# Altium project RUT2CLOUDPrjPcb.PrjPcb (part 1 of 2)
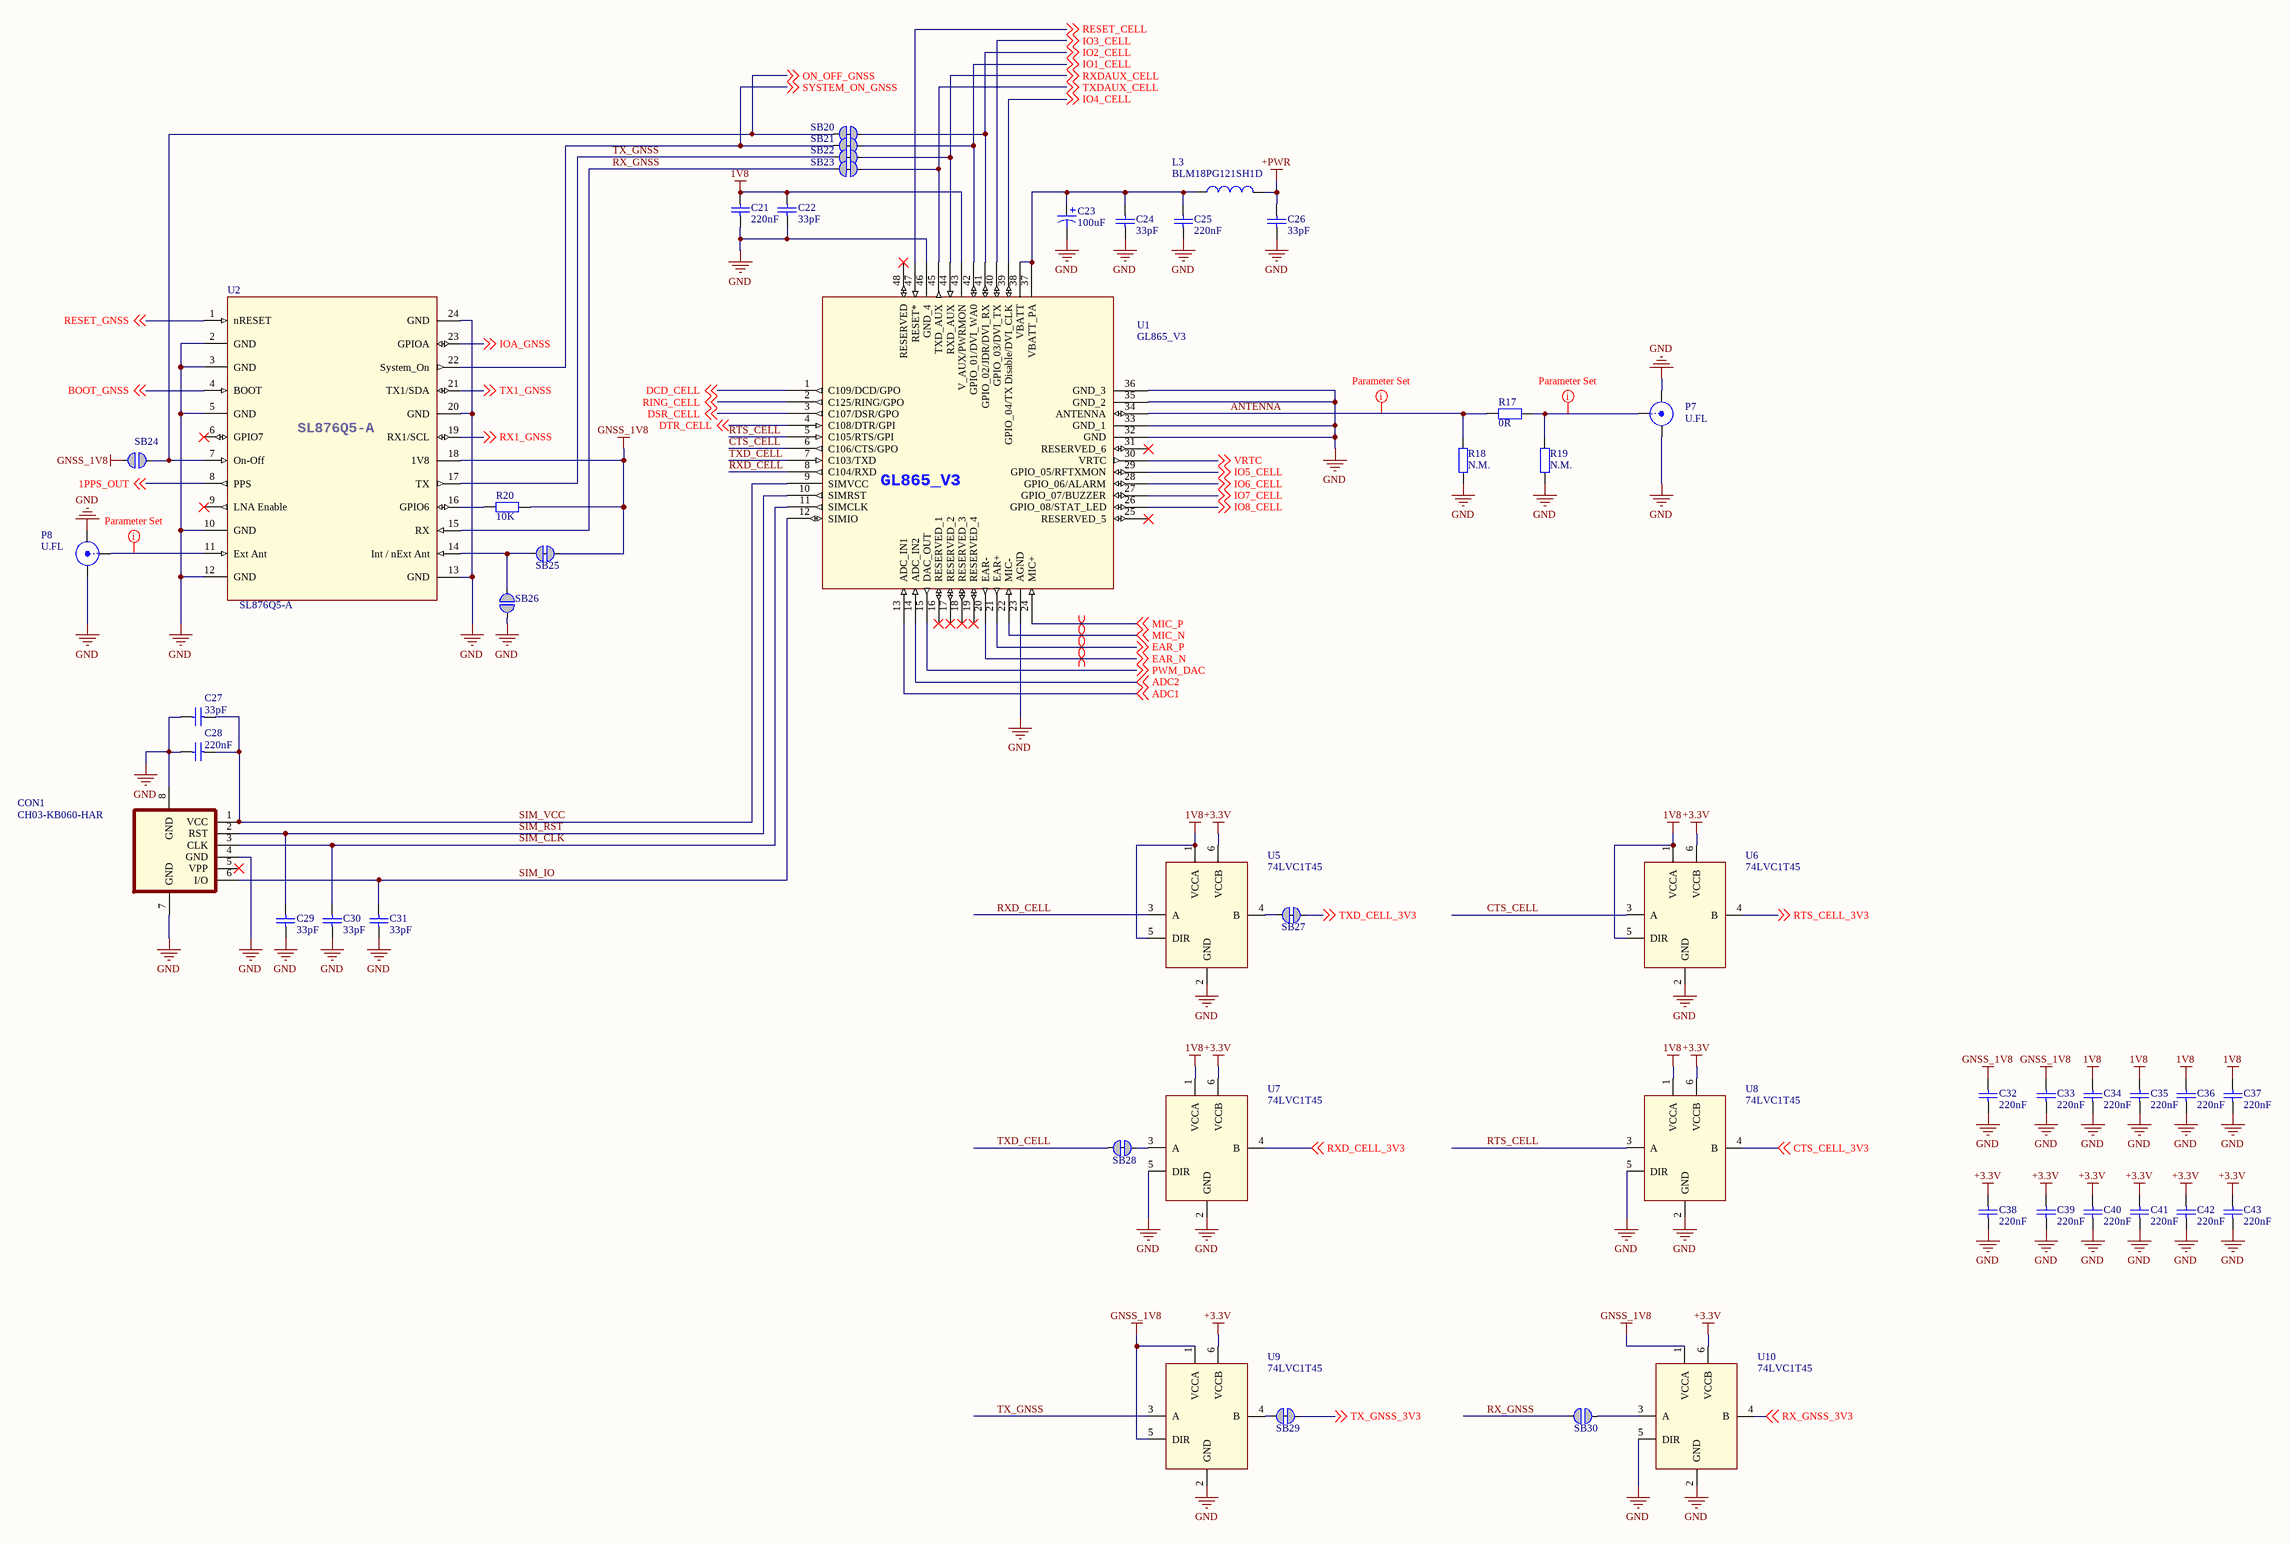
[diagram p0: Modem GNSS.SchDoc]
6 sheets, 262 parts. Net scope: global (net labels, ports and power ports of the same name join across sheets).
Board files: RUT2CLOUD.PcbDoc, RUT2CLOUD_panel.PcbDoc
Sheets:
  Modem GNSS.SchDoc
  Power management.SchDoc
  Sensors.SchDoc
  Connectors.SchDoc
  ST Link.SchDoc
  BLE_Controller.SchDoc

## Sheet Modem GNSS.SchDoc
size A2

### Parts
C21  value 220nF  [C0402]  (hidden comment: Cap Semi)
C22  value 33pF  [C0402]  (hidden comment: Cap Semi)
C23  value 100uF  [Case-B]  (hidden comment: electrolytic capacitor)
C24  value 33pF  [C0402]  (hidden comment: Cap Semi)
C25  value 220nF  [C0402]  (hidden comment: Cap Semi)
C26  value 33pF  [C0402]  (hidden comment: Cap Semi)
C27  value 33pF  [C0402]  (hidden comment: Cap Semi)
C28  value 220nF  [C0402]  (hidden comment: Cap Semi)
C29  value 33pF  [C0402]  (hidden comment: Cap Semi)
C30  value 33pF  [C0402]  (hidden comment: Cap Semi)
C31  value 33pF  [C0402]  (hidden comment: Cap Semi)
C32  value 220nF  [C0402]  (hidden comment: Cap Semi)
C33  value 220nF  [C0402]  (hidden comment: Cap Semi)
C34  value 220nF  [C0402]  (hidden comment: Cap Semi)
C35  value 220nF  [C0402]  (hidden comment: Cap Semi)
C36  value 220nF  [C0402]  (hidden comment: Cap Semi)
C37  value 220nF  [C0402]  (hidden comment: Cap Semi)
C38  value 220nF  [C0402]  (hidden comment: Cap Semi)
C39  value 220nF  [C0402]  (hidden comment: Cap Semi)
C40  value 220nF  [C0402]  (hidden comment: Cap Semi)
C41  value 220nF  [C0402]  (hidden comment: Cap Semi)
C42  value 220nF  [C0402]  (hidden comment: Cap Semi)
C43  value 220nF  [C0402]  (hidden comment: Cap Semi)
CON1  CH03-KB060-HAR  [CH03-KB]
L3  value BLM18PG121SH1D  [L0603]  (hidden comment: Inductor)
P7  U.FL  [U.FL_Connector_Male]
P8  U.FL  [U.FL_Connector_Male]
R17  value 0R  [R0402]  (hidden comment: Res2)
R18  value N.M.  [R0402]  (hidden comment: Res2)  (no BOM)
R19  value N.M.  [R0402]  (hidden comment: Res2)  (no BOM)
R20  value 10K  [R0402]  (hidden comment: Res2)
SB20  Solderbridge  [Solderbridge_Shorted]  (value not drawn)  (net tie, no BOM)
SB21  Solderbridge  [Solderbridge_Shorted]  (value not drawn)  (net tie, no BOM)
SB22  Solderbridge  [Solderbridge_Shorted]  (value not drawn)  (net tie, no BOM)
SB23  Solderbridge  [Solderbridge_Shorted]  (value not drawn)  (net tie, no BOM)
SB24  Solderbridge  [Solderbridge]  (value not drawn)  (no BOM)
SB25  Solderbridge  [Solderbridge_Shorted]  (value not drawn)  (net tie, no BOM)
SB26  Solderbridge  [Solderbridge]  (value not drawn)  (no BOM)
SB27  Solderbridge  [Solderbridge_Shorted]  (value not drawn)  (net tie, no BOM)
SB28  Solderbridge  [Solderbridge_Shorted]  (value not drawn)  (net tie, no BOM)
SB29  Solderbridge  [Solderbridge_Shorted]  (value not drawn)  (net tie, no BOM)
SB30  Solderbridge  [Solderbridge]  (value not drawn)  (no BOM)
U1  GL865_V3  [XL865XXX]
U2  SL876Q5-A  [SL876Q5-A]
U5  74LVC1T45  [X2-DFN1410-6]
U6  74LVC1T45  [X2-DFN1410-6]
U7  74LVC1T45  [X2-DFN1410-6]
U8  74LVC1T45  [X2-DFN1410-6]
U9  74LVC1T45  [X2-DFN1410-6]
U10  74LVC1T45  [X2-DFN1410-6]

### Nets
1V8: C21.2 C22.2 C34.1 C35.1 C36.1 C37.1 U1.43(V_AUX/PWRMON) U5.1(VCCA) U5.5(DIR) U6.1(VCCA) U6.5(DIR) U7.1(VCCA) U8.1(VCCA)
+3.3V: C38.1 C39.1 C40.1 C41.1 C42.1 C43.1 U5.6(VCCB) U6.6(VCCB) U7.6(VCCB) U8.6(VCCB) U9.6(VCCB) U10.6(VCCB)
+PWR: C26.2 L3.2
GND: C21.1 C22.1 C23.2 C24.1 C25.1 C26.1 C27.2 C28.2 C29.2 C30.2 C31.2 C32.2 C33.2 C34.2 C35.2 C36.2 C37.2 C38.2 C39.2 C40.2 C41.2 C42.2 C43.2 CON1.4(GND) CON1.7(GND) CON1.8(GND) P7.2(Y) P7.3(Y) P8.2(Y) P8.3(Y) R18.2 R19.2 SB26.1 U1.23(AGND) U1.32(GND) U1.33(GND_1) U1.35(GND_2) U1.36(GND_3) U1.46(GND_4) U2.2(GND) U2.3(GND) U2.5(GND) U2.10(GND) U2.12(GND) U2.13(GND) U2.20(GND) U2.24(GND) U5.2(GND) U6.2(GND) U7.2(GND) U7.5(DIR) U8.2(GND) U8.5(DIR) U9.2(GND) U10.2(GND) U10.5(DIR)
GNSS_1V8: C32.1 C33.1 R20.2 SB24.2 SB25.1 U2.18(1V8) U9.1(VCCA) U9.5(DIR) U10.1(VCCA)
1PPS_OUT: U2.8(PPS) ; off-sheet 1PPS_OUT
ADC1: U1.13(ADC_IN1) ; off-sheet ADC1
ADC2: U1.14(ADC_IN2) ; off-sheet ADC2
ANTENNA: R17.2 R18.1 U1.34(ANTENNA)
BOOT_GNSS: U2.4(BOOT) ; off-sheet BOOT_GNSS
CTS_CELL: U1.6(C106/CTS/GPO) U6.3(A)
CTS_CELL_3V3: U8.4(B) ; off-sheet CTS_CELL_3V3
DCD_CELL: U1.1(C109/DCD/GPO) ; off-sheet DCD_CELL
DSR_CELL: U1.3(C107/DSR/GPO) ; off-sheet DSR_CELL
DTR_CELL: U1.4(C108/DTR/GPI) ; off-sheet DTR_CELL
EAR_N: U1.20(EAR-) ; off-sheet EAR_N
EAR_P: U1.21(EAR+) ; off-sheet EAR_P
IO1_CELL: SB21.1 U1.42(GPIO_01/DVI_WA0) ; off-sheet IO1_CELL
IO2_CELL: SB20.1 U1.41(GPIO_02/JDR/DVI_RX) ; off-sheet IO2_CELL
IO3_CELL: U1.40(GPIO_03/DVI_TX) ; off-sheet IO3_CELL
IO4_CELL: U1.39(GPIO_04/TX_Disable/DVI_CLK) ; off-sheet IO4_CELL
IO5_CELL: U1.29(GPIO_05/RFTXMON) ; off-sheet IO5_CELL
IO6_CELL: U1.28(GPIO_06/ALARM) ; off-sheet IO6_CELL
IO7_CELL: U1.27(GPIO_07/BUZZER) ; off-sheet IO7_CELL
IO8_CELL: U1.26(GPIO_08/STAT_LED) ; off-sheet IO8_CELL
IOA_GNSS: U2.23(GPIOA) ; off-sheet IOA_GNSS
MIC_N: U1.22(MIC-) ; off-sheet MIC_N
MIC_P: U1.24(MIC+) ; off-sheet MIC_P
ON_OFF_GNSS: SB20.2 SB24.1 U2.7(On-Off) ; off-sheet ON_OFF_GNSS
PWM_DAC: U1.15(DAC_OUT) ; off-sheet PWM_DAC
RESET_CELL: U1.47(RESET*) ; off-sheet RESET_CELL
RESET_GNSS: U2.1(nRESET) ; off-sheet RESET_GNSS
RING_CELL: U1.2(C125/RING/GPO) ; off-sheet RING_CELL
RTS_CELL: U1.5(C105/RTS/GPI) U8.3(A)
RTS_CELL_3V3: U6.4(B) ; off-sheet RTS_CELL_3V3
RX1_GNSS: U2.19(RX1/SCL) ; off-sheet RX1_GNSS
RX_GNSS: SB23.2 SB30.2 U2.15(RX)
RX_GNSS_3V3: U10.4(B) ; off-sheet RX_GNSS_3V3
RXD_CELL: U1.8(C104/RXD) U5.3(A)
RXD_CELL_3V3: U7.4(B) ; off-sheet RXD_CELL_3V3
RXDAUX_CELL: SB22.1 U1.44(RXD_AUX) ; off-sheet RXDAUX_CELL
SIM_CLK: C30.1 CON1.3(CLK) U1.11(SIMCLK)
SIM_IO: C31.1 CON1.6(I/O) U1.12(SIMIO)
SIM_RST: C29.1 CON1.2(RST) U1.10(SIMRST)
SIM_VCC: C27.1 C28.1 CON1.1(VCC) U1.9(SIMVCC)
SYSTEM_ON_GNSS: SB21.2 U2.22(System_On) ; off-sheet SYSTEM_ON_GNSS
TX1_GNSS: U2.21(TX1/SDA) ; off-sheet TX1_GNSS
TX_GNSS: SB22.2 U2.17(TX) U9.3(A)
TX_GNSS_3V3: SB29.2 ; off-sheet TX_GNSS_3V3
TXD_CELL: SB28.1 U1.7(C103/TXD)
TXD_CELL_3V3: SB27.1 ; off-sheet TXD_CELL_3V3
TXDAUX_CELL: SB23.1 U1.45(TXD_AUX) ; off-sheet TXDAUX_CELL
VRTC: U1.30(VRTC) ; off-sheet VRTC
NetC23_1: C23.1 C24.2 C25.2 L3.1 U1.37(VBATT_PA) U1.38(VBATT)
NetP7_1: P7.1(X) R17.1 R19.1
NetP8_1: P8.1(X) U2.11(Ext_Ant)
NetR20_1: R20.1 U2.16(GPIO6)
NetSB25_2: SB25.2 SB26.2 U2.14(Int_/_nExt_Ant)
NetSB27_2: SB27.2 U5.4(B)
NetSB28_2: SB28.2 U7.3(A)
NetSB29_1: SB29.1 U9.4(B)
NetSB30_1: SB30.1 U10.3(A)

Not connected (* = marked no-connect by the designer): CON1 5(VPP)*; U1 16(RESERVED_1)* 17(RESERVED_2)* 18(RESERVED_3)* 19(RESERVED_4)* 25(RESERVED_5)* 31(RESERVED_6)* 48(RESERVED)*; U2 6(GPIO7)* 9(LNA_Enable)*

### Layout directives
rule Clearance Constraint [Clearance = 0.2mm]; rule Width Constraint [Pref Width = 1.1mm    Min Width = 0.2mm    Max Width = 4mm]: ANTENNA, NetP7_1, NetP8_1
differential pair: EAR_N, EAR_P, MIC_N, MIC_P

### Library data of the parts
C21 C25 C28 C32-C43 = Cap Semi: Capacitor (Semiconductor SIM Model); Manufacturer: YAGEO; Manufacturer Part No.: CC0402KRX5R5BB224; Part Description: Ceramic Capacitor; Specification: X5R, 6.3V, 10%; Supplier: Rutronik; Supplier part number: KKK23148; Link: https://www.rutronik24.com/product/yageo/cc0402krx5r5bb224/3611951.html
C22 C24 C26 C27 C29-C31 = Cap Semi: Capacitor (Semiconductor SIM Model); Manufacturer: AVX; Manufacturer Part No.: 04025A330JAT2A; Part Description: Ceramic Capacitor; Specification: NP0, 6.3V, 5%; Supplier: Rutronik; Supplier part number: KKK13594; Link: https://www.rutronik24.com/product/avx/04025a330jat2a/3692730.html
C23 = Cap Pol1: Manufacturer: AVX; Manufacturer Part No.: TPSB107K006R0400; Part Description: Tantalum Capacitor; Specification: 6,3V 20%; Supplier: Rutronik; Supplier part number: KTA5959; Link: https://www.rutronik24.com/product/avx/tpsb107k006r0400/3688840.html
CON1 = CH03-KB060-HAR: Nano SIM Card Connector; Manufacturer: GradConn; Specification: Nano, 6 pins; Manufacturer Part No.: CH03-KB060-HAR; Supplier: Rutronik; Supplier part number: SIMCRD1002; Value: CH03-KB060-HAR; Part Description: Nano SIM Card Connector; Link: https://www.rutronik24.com/product/gradconn/ch03-kb060-har/7026333.html
L3 = Inductor: Manufacturer: muRata; Part Description: Ferrite Bead; Specification: 120R, 2A; Manufacturer Part No.: BLM18PG121SH1D; Supplier: Rutronik; Supplier part number: FE3867; Link: https://www.rutronik24.com/product/murata/blm18pg121sh1d/5885588.html
P7 P8 = SMB: Manufacturer: HIROSE; Manufacturer Part No.: U.FL-R-SMT-1(10); Part Description: U.FL Connector; Specification: Male; Value: U.FL-R-SMT-1(10); Supplier: Rutronik; Supplier part number: COREC23028; Link: https://www.hirose.com/product/en/products/U.FL/U.FL-R-SMT-1%2810%29/
R17-R19 = Res2: Manufacturer: YAGEO; Manufacturer Part No.: RC0402FR-070RL; Part Description: Thick Film Resistor; Specification: 5% 0,063W; Supplier: Rutronik; Supplier part number: WRC53079; Link: https://www.rutronik24.com/product/yageo/rc0402fr-070rl/5183530.html
R20 = Res2: Manufacturer: ASJ; Manufacturer Part No.: CR10-103-JK; Part Description: Thick Film Resistor; Specification: 5% 0,063W; Supplier: Rutronik; Supplier part number: WRC40976; Link: https://www.rutronik24.com/product/asj/cr10-103-jk/54295.html
SB20-SB23 SB25 SB27-SB29 = Solderbridge Shorted: Manufacturer: *; Value: Solderbridge; Supplier: *; Supplier part number: *
U1 = GL865_V3: Manufacturer: Telit; Manufacturer Part No.: GL865-DUAL V3.1; Part Description: Cellular Module; Specification: Dual  Band; Value: GL865-DUAL V3.1; Supplier: Rutronik; Supplier part number: GSM1755; Link: https://www.rutronik24.com/product/telit/gl865d31613t001/9566944.html
U2 = SL876Q5-A: Manufacturer: Telit; Part Description: GNSS Embedded Module; Specification: GPS, Glonass; Manufacturer Part No.: SL876Q5-A; Supplier: Rutronik; Supplier part number: GPS1354; Value: SL876Q5-A; Link: https://www.rutronik24.com/product/telit/sl876q5a001t001000/9723106.html
U5-U10 = 74LVC1T45: Manufacturer: Diodes Inc.; Manufacturer Part No.: 74LVC1T45FZ4-7; Part Description: Single Bit Voltage Level Translator; Specification: 5.5V, 1.65V; Value: 74LVC1T45FZ4-7; Supplier: Rutronik; Supplier part number: 74LVC1T45FZ4-7; Link: https://www.rutronik24.com/product/diodes+inc/74lvc1t45w6-7/7622634.html
SB24 SB26 SB30 = Solderbridge: Manufacturer: *; Value: Solderbridge; Supplier: *; Supplier part number: *

## Sheet Power management.SchDoc
size A3
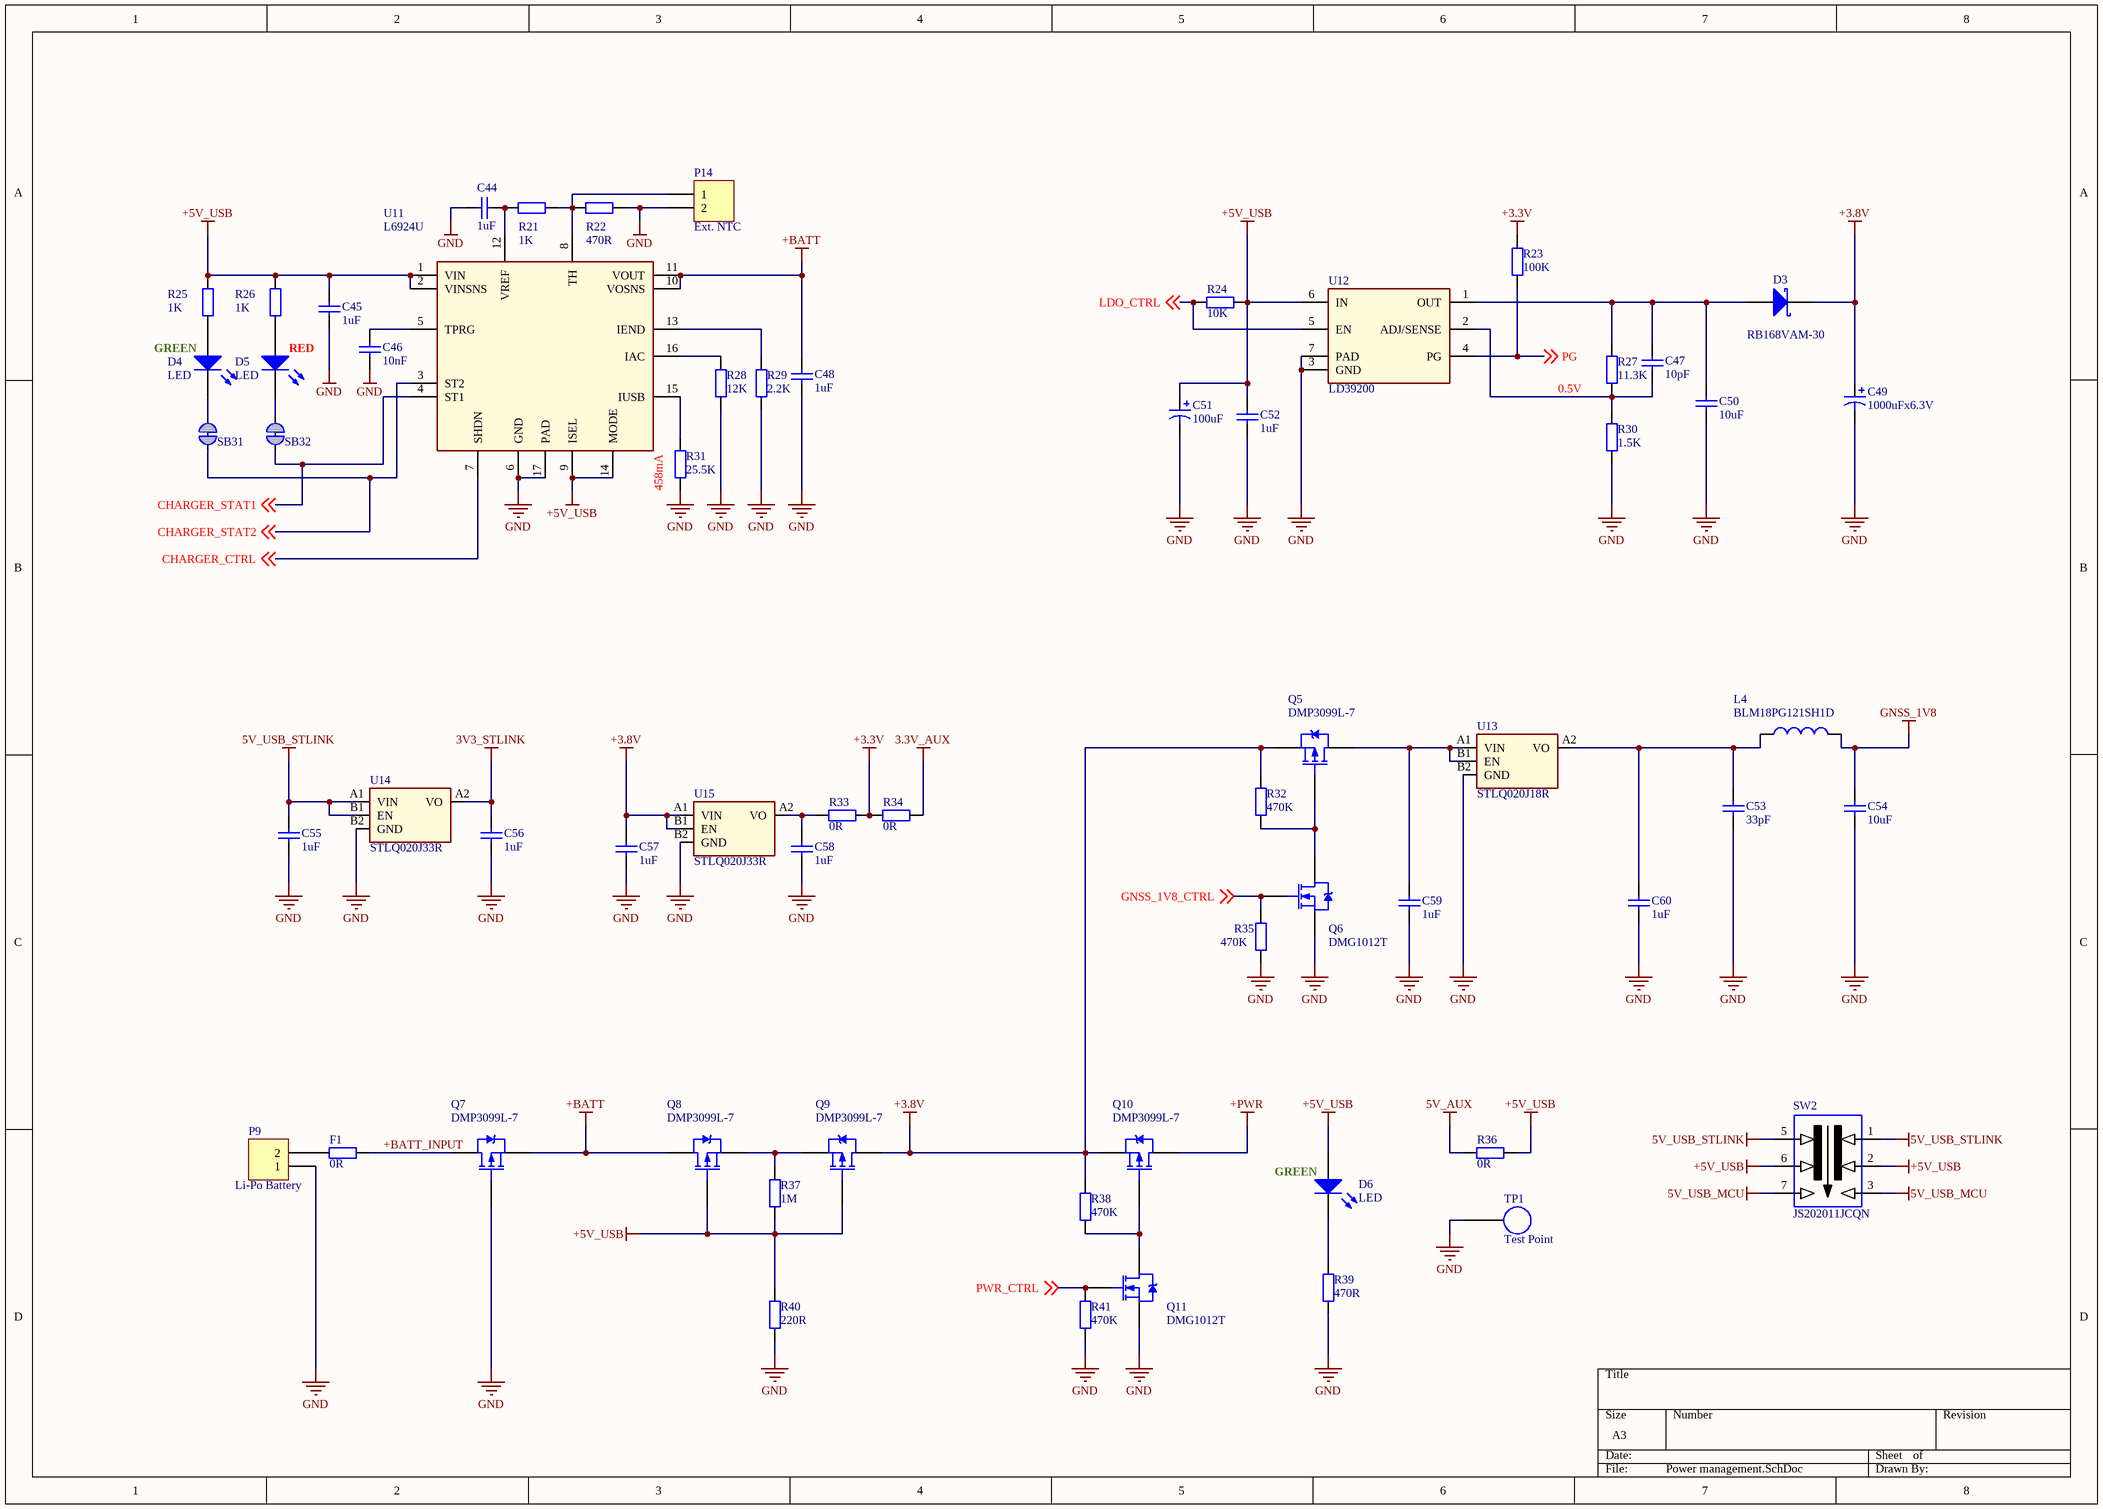
[diagram p1: Power management.SchDoc]

### Parts
C44  value 1uF  [C0402]  (hidden comment: Cap Semi)
C45  value 1uF  [C0402]  (hidden comment: Cap Semi)
C46  value 10nF  [C0402]  (hidden comment: Cap Semi)
C47  value 10pF  [C0402]  (hidden comment: Cap Semi)
C48  value 1uF  [C0402]  (hidden comment: Cap Semi)
C49  value 1000uFx6.3V  [7361-38]  (hidden comment: electrolytic capacitor)
C50  value 10uF  [C0402]  (hidden comment: Cap Semi)
C51  value 100uF  [Case-B]  (hidden comment: electrolytic capacitor)
C52  value 1uF  [C0402]  (hidden comment: Cap Semi)
C53  value 33pF  [C0402]  (hidden comment: Cap Semi)
C54  value 10uF  [C0402]  (hidden comment: Cap Semi)
C55  value 1uF  [C0402]  (hidden comment: Cap Semi)
C56  value 1uF  [C0402]  (hidden comment: Cap Semi)
C57  value 1uF  [C0402]  (hidden comment: Cap Semi)
C58  value 1uF  [C0402]  (hidden comment: Cap Semi)
C59  value 1uF  [C0402]  (hidden comment: Cap Semi)
C60  value 1uF  [C0402]  (hidden comment: Cap Semi)
D3  RB168VAM-30  [SOD323]
D4  LED  [PICOLED]
D5  LED  [PICOLED]
D6  LED  [PICOLED]
F1  value 0R  [R0603]  (hidden comment: Res2)
L4  value BLM18PG121SH1D  [L0603]  (hidden comment: Inductor)
P9  Li-Po Battery  [104238-0210  Molex]
P14  Ext. NTC  [HDR1X2H]  (no BOM)
Q5  DMP3099L-7  [SOT23_custom]
Q6  DMG1012T  [SOT-523_custom]
Q7  DMP3099L-7  [SOT23_custom]
Q8  DMP3099L-7  [SOT23_custom]
Q9  DMP3099L-7  [SOT23_custom]
Q10  DMP3099L-7  [SOT23_custom]
Q11  DMG1012T  [SOT-523_custom]
R21  value 1K  [R0402]  (hidden comment: Res2)
R22  value 470R  [R0402]  (hidden comment: Res2)
R23  value 100K  [R0402]  (hidden comment: Res2)
R24  value 10K  [R0402]  (hidden comment: Res2)
R25  value 1K  [R0402]  (hidden comment: Res2)
R26  value 1K  [R0402]  (hidden comment: Res2)
R27  value 11.3K  [R0402]  (hidden comment: Res2)
R28  value 12K  [R0402]  (hidden comment: Res2)
R29  value 2.2K  [R0402]  (hidden comment: Res2)
R30  value 1.5K  [R0402]  (hidden comment: Res2)
R31  value 25.5K  [R0402]  (hidden comment: Res2)
R32  value 470K  [R0402]  (hidden comment: Res2)
R33  value 0R  [R0402]  (hidden comment: Res2)
R34  value 0R  [R0402]  (hidden comment: Res2)
R35  value 470K  [R0402]  (hidden comment: Res2)
R36  value 0R  [R0402]  (hidden comment: Res2)
R37  value 1M  [R0402]  (hidden comment: Res2)
R38  value 470K  [R0402]  (hidden comment: Res2)
R39  value 470R  [R0402]  (hidden comment: Res2)
R40  value 220R  [R0402]  (hidden comment: Res2)
R41  value 470K  [R0402]  (hidden comment: Res2)
SB31  Solderbridge  [Solderbridge_Shorted]  (value not drawn)  (net tie, no BOM)
SB32  Solderbridge  [Solderbridge_Shorted]  (value not drawn)  (net tie, no BOM)
SW2  JS202011JCQN  [JS202011JCQN]
TP1  Test Point  [5019_keystone]
U11  L6924U  [VFQFPN16]
U12  LD39200  [DFN6]
U13  STLQ020J18R  [Flip-Chip4]
U14  STLQ020J33R  [Flip-Chip4]
U15  STLQ020J33R  [Flip-Chip4]

### Nets
3.3V_AUX: R34.1
3V3_STLINK: C56.1 U14.A2(VO)
5V_AUX: R36.2
5V_USB_MCU: SW2.3 SW2.7
5V_USB_STLINK: C55.1 SW2.1 SW2.5 U14.A1(VIN) U14.B1(EN)
+3.3V: R23.2 R33.1 R34.2
+3.8V: C49.1 C57.1 D3.2(K) Q5.3(S) Q9.1(D) Q10.3(S) R32.2 R38.2 U15.A1(VIN) U15.B1(EN)
+5V_USB: C45.1 C51.1 C52.2 D6.1(A) Q8.2(G) Q9.2(G) R24.2 R25.1 R26.1 R36.1 R37.2 R40.2 SW2.2 SW2.6 U11.1(VIN) U11.2(VINSNS) U11.9(ISEL) U11.14(MODE) U12.6(IN)
+BATT: C48.1 Q7.3(S) Q8.1(D) U11.10(VOSNS) U11.11(VOUT)
+PWR: Q10.1(D)
GND: C44.2 C45.2 C46.2 C48.2 C49.2 C50.1 C51.2 C52.1 C53.1 C54.2 C55.2 C56.2 C57.2 C58.2 C59.2 C60.2 P9.1 P14.2 Q6.3(S) Q7.2(G) Q11.3(S) R22.2 R28.2 R29.2 R30.2 R31.2 R35.1 R39.2 R40.1 R41.1 TP1.1 U11.6(GND) U11.17(PAD) U12.3(GND) U12.7(PAD) U13.B2(GND) U14.B2(GND) U15.B2(GND)
GNSS_1V8: C54.1 L4.2
+BATT_INPUT: F1.2 Q7.1(D)
CHARGER_CTRL: U11.7(SHDN) ; off-sheet CHARGER_CTRL
CHARGER_STAT1: SB32.2 U11.4(ST1) ; off-sheet CHARGER_STAT1
CHARGER_STAT2: SB31.2 U11.3(ST2) ; off-sheet CHARGER_STAT2
GNSS_1V8_CTRL: Q6.1(G) R35.2 ; off-sheet GNSS_1V8_CTRL
LDO_CTRL: R24.1 U12.5(EN) ; off-sheet LDO_CTRL
PG: R23.1 U12.4(PG) ; off-sheet PG
PWR_CTRL: Q11.1(G) R41.2 ; off-sheet PWR_CTRL
NetC44_1: C44.1 R21.1 U11.12(VREF)
NetC46_1: C46.1 U11.5(TPRG)
NetC47_1: C47.1 R27.2 R30.1 U12.2(ADJ/SENSE)
NetC47_2: C47.2 C50.2 D3.1(A) R27.1 U12.1(OUT)
NetC53_2: C53.2 C60.1 L4.1 U13.A2(VO)
NetC58_1: C58.1 R33.2 U15.A2(VO)
NetC59_1: C59.1 Q5.1(D) U13.A1(VIN) U13.B1(EN)
NetD4_1: D4.1(A) R25.2
NetD4_2: D4.2(K) SB31.1
NetD5_1: D5.1(A) R26.2
NetD5_2: D5.2(K) SB32.1
NetD6_2: D6.2(K) R39.1
NetF1_1: F1.1 P9.2
NetP14_1: P14.1 R21.2 R22.1 U11.8(TH)
NetQ5_2: Q5.2(G) Q6.2(D) R32.1
NetQ8_3: Q8.3(S) Q9.3(S) R37.1
NetQ10_2: Q10.2(G) Q11.2(D) R38.1
NetR28_1: R28.1 U11.16(IAC)
NetR29_1: R29.1 U11.13(IEND)
NetR31_1: R31.1 U11.15(IUSB)

### Notes on the sheet
- GREEN
- (near D5) RED
- 0.5V
- 458mA
- (near D6) GREEN

### Library data of the parts
C44-C46 C48 = Cap Semi: Capacitor (Semiconductor SIM Model); Manufacturer: Samsung Electronics; Manufacturer Part No.: CL05B102KB5NNND; Part Description: Ceramic Capacitor; Specification: X5R, 6.3V, 10%; Supplier: Rutronik; Supplier part number: KKK22306; Link: https://www.rutronik24.com/product/samsung+em/cl05b102kb5nnnd/7450031.html
C47 = Cap Semi: Capacitor (Semiconductor SIM Model); Manufacturer: YAGEO; Manufacturer Part No.: CC0402JRNPO9BN100; Part Description: Ceramic Capacitor; Specification: NP0, 6.3V, 5%; Supplier: Rutronik; Supplier part number: KKK14556; Link: https://www.rutronik24.com/product/yageo/cc0402jrnpo9bn100/29735.html
C49 = Cap Pol1: Manufacturer: AVX; Manufacturer Part No.: TPSV108M006R0050; Part Description: Tantalum Capacitor; Specification: 6,3V 20%; Supplier: Rutronik; Supplier part number: TPSV108M006R0050; Link: https://www.rutronik24.com/product/avx/tpsv108m006r0050/11647835.html
C50 C52 C54 = Cap Semi: Capacitor (Semiconductor SIM Model); Manufacturer: Samsung Electronics; Manufacturer Part No.: CL05A106MP5NUNC; Part Description: Ceramic Capacitor; Specification: X5R, 6.3V, 20%; Supplier: Rutronik; Supplier part number: KKS2857; Link: https://www.rutronik24.com/product/samsung+em/cl05a106mp5nunc/32408.html
C51 = Cap Pol1: as C23 on sheet Modem GNSS; Supplier: Rutronik; Supplier part number: KTA5959; Link: https://www.rutronik24.com/product/avx/tpsb107k006r0400/3688840.html
C53 = Cap Semi: as C22 on sheet Modem GNSS; Supplier: Rutronik; Supplier part number: KKK13594; Link: https://www.rutronik24.com/product/avx/04025a330jat2a/3692730.html
C55-C60 = Cap Semi: Capacitor (Semiconductor SIM Model); Manufacturer: Samsung Electronics; Manufacturer Part No.: CL05A225MQ5NNNC; Part Description: Ceramic Capacitor; Specification: X5R, 6.3V, 10%; Supplier: Rutronik; Supplier part number: KKS2678; Link: https://www.rutronik24.com/product/samsung+em/cl05a225mq5nnnc/32280.html
D3 = D Schottky: Schottky Diode; Manufacturer: ROHM; Part Description: Low VF Schottky Barrier Rectifier; Specification: 30V, 1A; Manufacturer Part No.: RB168VAM-30; Supplier: Rutronik; Supplier part number: RB168VAM-30; Value: RB168VAM-30; Link: http://rohmfs.rohm.com/en/products/databook/datasheet/discrete/diode/schottky_barrier/rb168vam-30tr-e.pdf
D4 D6 = LED2: Typical SMD LED; Manufacturer: ROHM; Manufacturer Part No.: SML-P13PTT86R; Specification: Green, 20mA; Value: SML-P13PTT86R; Supplier: Rutronik; Supplier part number: LED26047; Part Description: Typical SMD LED; Link: https://www.rutronik24.com/product/rohm/sml-p13ptt86r/11064312.html
D5 = LED2: Typical SMD LED; Manufacturer: ROHM; Manufacturer Part No.: SML-P12UTT86; Specification: Red, 20mA; Value: SML-P12UTT86; Supplier: Rutronik; Supplier part number: LED24884; Part Description: Typical SMD LED; Link: https://www.rutronik24.com/product/rohm/sml-p12utt86/8485748.html
F1 R33 R34 R36 = Res2: as R17 on sheet Modem GNSS; Supplier: Rutronik; Supplier part number: WRC53079; Link: https://www.rutronik24.com/product/yageo/rc0402fr-070rl/5183530.html
L4 = Inductor: as L3 on sheet Modem GNSS; Manufacturer Part No.: BLM18PG121SH1D; Supplier: Rutronik; Supplier part number: FE3867; Link: https://www.rutronik24.com/product/murata/blm18pg121sh1d/5885588.html
P9 = Header 2: Manufacturer: Molex; Manufacturer Part No.: 104238-0210; Part Description: Terminal; Specification: 2 pins, 5 mm pitch; Value: 104238-0210; Supplier: Rutronik; Supplier part number: COREC38239; Link: https://www.molex.com/molex/products/datasheet.jsp?part=active/1042380210_PCB_RECEPTACLES.xml
P14 = Header 2H: Header, 2-Pin, Right Angle
Q5 Q7-Q10 = IRF5NJ5305: Manufacturer: Diodes Inc.; Part Description: P-Channel MOSFET; Specification: -30V, -3.8A; Manufacturer Part No.: DMP3099L-7; Supplier: Rutronik; Supplier part number: TMOSS6836; Value: DMP3099L-7; Link: https://www.rutronik24.com/product/diodes+inc/dmp3099l-7/5168905.html
Q6 Q11 = NMOS-2: N-Channel Power MOSFET; Manufacturer: Diodes Inc.; Manufacturer Part No.: DMG1012T-7; Part Description: N-Channel MOSFET; Specification: 20V, 0.63A; Value: DMG1012T-7; Supplier: Rutronik; Supplier part number: TMOSS6623; Link: https://www.rutronik24.com/product/diodes+inc/dmg1012t-7/5168665.html
R21 R22 R25 R26 R28 R29 R31 R39 = Res2: Manufacturer: ASJ; Manufacturer Part No.: CR10-471-JK; Part Description: Thick Film Resistor; Specification: 5% 0,063W; Supplier: Rutronik; Supplier part number: WRC41425; Link: https://www.rutronik24.com/product/asj/cr10-471-jk/54391.html
R23 = Res2: Manufacturer: ASJ; Manufacturer Part No.: CR10-104-JK; Part Description: Thick Film Resistor; Specification: 5% 0,063W; Supplier: Rutronik; Supplier part number: WRC34858; Link: https://www.rutronik24.com/product/asj/cr10-104-jk/51752.html
R24 R27 = Res2: as R20 on sheet Modem GNSS; Supplier: Rutronik; Supplier part number: WRC40976; Link: https://www.rutronik24.com/product/asj/cr10-103-jk/54295.html
R30 = Res2: Manufacturer: YAGEO; Manufacturer Part No.: RC0402JR-071K5L; Part Description: Thick Film Resistor; Specification: 5% 0,063W; Supplier: Rutronik; Supplier part number: WRC33836; Link: https://www.rutronik24.com/product/yageo/rc0402jr-071k5l/51006.html
R32 R35 R38 R41 = Res2: Manufacturer: ASJ; Manufacturer Part No.: CR10-474-JK; Part Description: Thick Film Resistor; Specification: 5% 0,063W; Supplier: Rutronik; Supplier part number: WRC35429; Link: https://www.rutronik24.com/product/asj/cr10-474-jk/52065.html
R37 = Res2: Manufacturer: ASJ; Manufacturer Part No.: CR10-105-JK; Part Description: Thick Film Resistor; Specification: 5% 0,063W; Supplier: Rutronik; Supplier part number: WRC35254; Link: https://www.rutronik24.com/product/asj/cr10-105-jk/51971.html
R40 = Res2: Manufacturer: ASJ; Manufacturer Part No.: CR10-221-JK; Part Description: Thick Film Resistor; Specification: 5% 0,063W; Supplier: Rutronik; Supplier part number: WRC35108; Link: https://www.rutronik24.com/product/asj/cr10-221-jk/51883.html
SB31 SB32 = Solderbridge Shorted: Manufacturer: *; Value: Solderbridge; Supplier: *; Supplier part number: *
SW2 = JS202011JCQN: Sub-Miniature Slide Switch, VERTICAL MOUNT SMT - J BEND; Manufacturer: CK Switches; Specification: 6V DC, 0.3A; Link: https://www.ckswitches.com/media/1422/js.pdf; Manufacturer Part No.: JS202011JCQN; Part Description: VERTICAL MOUNT SMT - J BEND; Supplier: Rutronik; Supplier part number: SWITCH10809; Value: JS202011JCQN
TP1 = 5019: SMD Test Point; Manufacturer: Keystone Electrincs; Part Description: SMT Test Point; Specification: 3.81*2.03; Value: 5019; Manufacturer Part No.: 5019; Supplier: Rutronik; Supplier part number: BAT4950; Link: https://www.rutronik24.com/product/keystone/5019/7028403.html
U11 = L6924D: Battery charger system / with integrated power switch for Li-Ion/Li-Polymer; Manufacturer: STMicroelectronics; Part Description: USB compatible battery charger system  with integrated power switch for Li-Ion/Li-Polymer; Specification: 12V, 1A, Li-PO; Link: https://www.rutronik24.com/product/st/l6924utr/8297844.html; Manufacturer Part No.: L6924U; Supplier: Rutronik; Supplier part number: ICPWM6861; Value: L6924U
U12 = LD39200: 2 A high PSRR ultra low drop linear regulator with reverse current protection; Manufacturer: STMicroelectronics; Manufacturer Part No.: LD39200PUR; Specification: 2A ADJ.; Value: LD39200PUR; Link: https://www.rutronik24.com/product/st/ld39200pur/8309892.html; Part Description: 2 A high PSRR ultra low drop linear regulator with reverse current protection; Supplier: Rutronik; Supplier part number: ICSPR10216
U13 = STLQ020: LDO; Manufacturer: STMicroelectronics; Part Description: 200 mA ultra-low quiescent current LDO; Specification: 1.8V, 200mA; Manufacturer Part No.: STLQ020J18R; Supplier: Rutronik; Supplier part number: ICSPR10227; Value: STLQ020J18R; Link: https://www.rutronik24.com/product/st/stlq020j18r/10086303.html
U14 U15 = STLQ020: LDO; Manufacturer: STMicroelectronics; Part Description: 200 mA ultra-low quiescent current LDO; Specification: 3.3V, 200mA; Manufacturer Part No.: STLQ020J33R; Supplier: Rutronik; Supplier part number: STLQ020J33R; Value: STLQ020J33R; Link: https://www.rutronik24.com/product/st/stlq020j33r/12065124.html

## Sheet Sensors.SchDoc
size A3
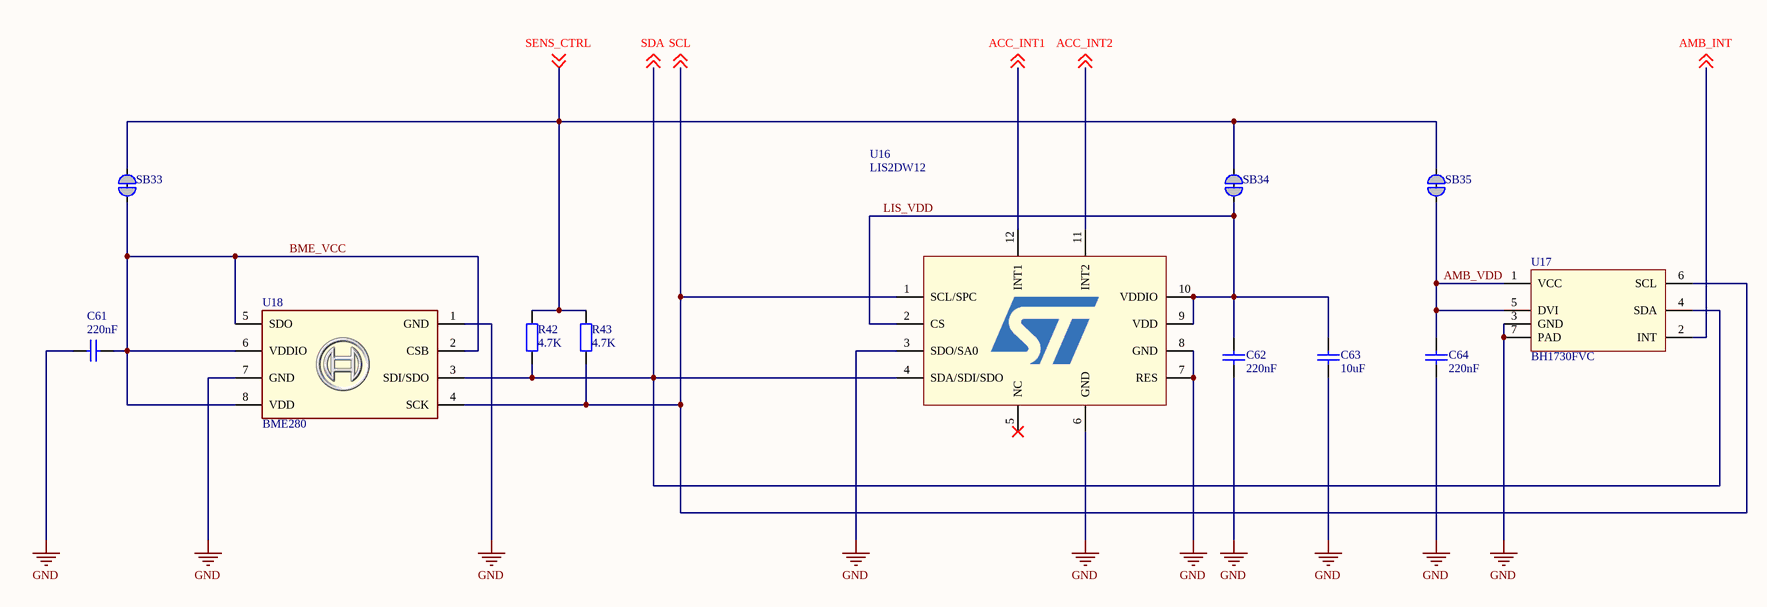
[diagram p2: Sensors.SchDoc]

### Parts
C61  value 220nF  [C0402]  (hidden comment: Cap Semi)
C62  value 220nF  [C0402]  (hidden comment: Cap Semi)
C63  value 10uF  [C0402]  (hidden comment: Cap Semi)
C64  value 220nF  [C0402]  (hidden comment: Cap Semi)
R42  value 4.7K  [R0402]  (hidden comment: Res2)
R43  value 4.7K  [R0402]  (hidden comment: Res2)
SB33  Solderbridge  [Solderbridge_Shorted]  (value not drawn)  (net tie, no BOM)
SB34  Solderbridge  [Solderbridge_Shorted]  (value not drawn)  (net tie, no BOM)
SB35  Solderbridge  [Solderbridge_Shorted]  (value not drawn)  (net tie, no BOM)
U16  LIS2DW12  [LGA-12 package]
U17  BH1730FVC  [WSOF6]
U18  BME280  [BME280]

### Nets
GND: C61.2 C62.2 C63.2 C64.2 U16.3(SDO/SA0) U16.6(GND) U16.7(RES) U16.8(GND) U17.3(GND) U17.7(PAD) U18.1(GND) U18.7(GND)
ACC_INT1: U16.12(INT1) ; off-sheet ACC_INT1
ACC_INT2: U16.11(INT2) ; off-sheet ACC_INT2
AMB_INT: U17.2(INT) ; off-sheet AMB_INT
AMB_VDD: C64.1 SB35.2 U17.1(VCC) U17.5(DVI)
BME_VCC: C61.1 SB33.2 U18.2(CSB) U18.5(SDO) U18.6(VDDIO) U18.8(VDD)
LIS_VDD: C62.1 C63.1 SB34.2 U16.2(CS) U16.9(VDD) U16.10(VDDIO)
SCL: R43.2 U16.1(SCL/SPC) U17.6(SCL) U18.4(SCK) ; off-sheet SCL
SDA: R42.2 U16.4(SDA/SDI/SDO) U17.4(SDA) U18.3(SDI/SDO) ; off-sheet SDA
SENS_CTRL: R42.1 R43.1 SB33.1 SB34.1 SB35.1 ; off-sheet SENS_CTRL

Not connected (* = marked no-connect by the designer): U16 5(NC)*

### Library data of the parts
C61-C64 = Cap Semi: as C21 on sheet Modem GNSS; Supplier: Rutronik; Supplier part number: KKK23148; Link: https://www.rutronik24.com/product/yageo/cc0402krx5r5bb224/3611951.html
R42 R43 = Res2: Manufacturer: ASJ; Manufacturer Part No.: CR10-472-JK; Part Description: Thick Film Resistor; Specification: 5% 0,063W; Supplier: Rutronik; Supplier part number: WRC41427; Link: https://www.rutronik24.com/product/asj/cr10-472-jk/54393.html
SB33-SB35 = Solderbridge Shorted: Manufacturer: *; Value: Solderbridge; Supplier: *; Supplier part number: *
U16 = LIS2DW12: MEMS digital output motion sensor: high-performance ultra-low-power 3-axis / "femto" accelerometer; Manufacturer: STMicroelectronics; Manufacturer Part No.: LIS2DW12TR; Specification: 1.62V, 3.6V, 2-8g; Value: LIS2DW12TR; Link: https://www.rutronik24.com/product/st/lis2dw12tr/8441777.html; Part Description: MEMS digital output motion sensor: high-performance ultra-low-power 3-axis  "femto" accelerometer; Supplier: Rutronik; Supplier part number: ICMEMS1297
U17 = BH1730FVC: Digital 16bit Serial Output Type Ambient Light Sensor IC; Manufacturer: ROHM; Manufacturer Part No.: BH1730FVC-TR; Specification: 2.4V, 3.6V, 100klx; Value: BH1730FVC-TR; Link: https://www.rutronik24.com/product/rohm/bh1730fvc-tr/5199695.html; Part Description: Digital 16bit Serial Output Type  Ambient Light Sensor IC; Supplier: Rutronik; Supplier part number: ICIN3260
U18 = BME280: Manufacturer: BOSH; Part Description: Pressure, Humidity, tempereture Sensor; Specification: I2C, SPI, 3.6uA; Manufacturer Part No.: BME280; Supplier: Rutronik; Supplier part number: ICIN3565; Value: BME280; Link: https://www.rutronik24.com/product/bosch+se/bme280/6440107.html

## Sheet Connectors.SchDoc
size A4
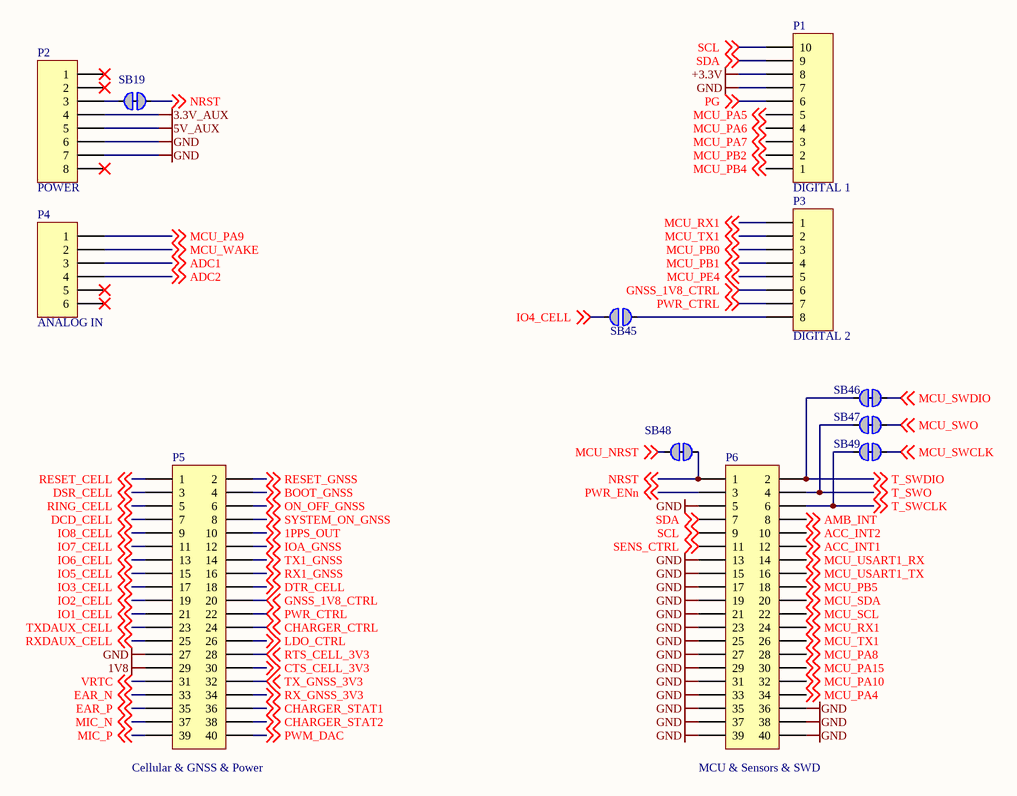
[diagram p3: Connectors.SchDoc]

### Parts
P1  DIGITAL 1  [HDR1X10]
P2  POWER  [HDR1X8]  (no BOM)
P3  DIGITAL 2  [HDR1X8]  (no BOM)
P4  ANALOG IN  [HDR1X6]  (no BOM)
P5  Cellular & GNSS & Power  [HDR2X20]  (no BOM)
P6  MCU & Sensors & SWD  [HDR2X20]  (no BOM)
SB19  Solderbridge  [Solderbridge_Shorted]  (value not drawn)  (net tie, no BOM)
SB45  Solderbridge  [Solderbridge]  (value not drawn)  (no BOM)
SB46  Solderbridge  [Solderbridge_Shorted]  (value not drawn)  (net tie, no BOM)
SB47  Solderbridge  [Solderbridge_Shorted]  (value not drawn)  (net tie, no BOM)
SB48  Solderbridge  [Solderbridge_Shorted]  (value not drawn)  (net tie, no BOM)
SB49  Solderbridge  [Solderbridge_Shorted]  (value not drawn)  (net tie, no BOM)

### Nets
1V8: P5.29
3.3V_AUX: P2.4
5V_AUX: P2.5
+3.3V: P1.8
GND: P1.7 P2.6 P2.7 P5.27 P6.5 P6.13 P6.15 P6.17 P6.19 P6.21 P6.23 P6.25 P6.27 P6.29 P6.31 P6.33 P6.35 P6.36 P6.37 P6.38 P6.39 P6.40
1PPS_OUT: P5.10 ; off-sheet 1PPS_OUT
ACC_INT1: P6.12 ; off-sheet ACC_INT1
ACC_INT2: P6.10 ; off-sheet ACC_INT2
ADC1: P4.3 ; off-sheet ADC1
ADC2: P4.4 ; off-sheet ADC2
AMB_INT: P6.8 ; off-sheet AMB_INT
BOOT_GNSS: P5.4 ; off-sheet BOOT_GNSS
CHARGER_CTRL: P5.24 ; off-sheet CHARGER_CTRL
CHARGER_STAT1: P5.36 ; off-sheet CHARGER_STAT1
CHARGER_STAT2: P5.38 ; off-sheet CHARGER_STAT2
CTS_CELL_3V3: P5.30 ; off-sheet CTS_CELL_3V3
DCD_CELL: P5.7 ; off-sheet DCD_CELL
DSR_CELL: P5.3 ; off-sheet DSR_CELL
DTR_CELL: P5.18 ; off-sheet DTR_CELL
EAR_N: P5.33 ; off-sheet EAR_N
EAR_P: P5.35 ; off-sheet EAR_P
GNSS_1V8_CTRL: P3.6 P5.20 ; off-sheet GNSS_1V8_CTRL
IO1_CELL: P5.21 ; off-sheet IO1_CELL
IO2_CELL: P5.19 ; off-sheet IO2_CELL
IO3_CELL: P5.17 ; off-sheet IO3_CELL
IO4_CELL: SB45.2 ; off-sheet IO4_CELL
IO5_CELL: P5.15 ; off-sheet IO5_CELL
IO6_CELL: P5.13 ; off-sheet IO6_CELL
IO7_CELL: P5.11 ; off-sheet IO7_CELL
IO8_CELL: P5.9 ; off-sheet IO8_CELL
IOA_GNSS: P5.12 ; off-sheet IOA_GNSS
LDO_CTRL: P5.26 ; off-sheet LDO_CTRL
MCU_NRST: SB48.1 ; off-sheet MCU_NRST
MCU_PA4: P6.34 ; off-sheet MCU_PA4
MCU_PA5: P1.5 ; off-sheet MCU_PA5
MCU_PA6: P1.4 ; off-sheet MCU_PA6
MCU_PA7: P1.3 ; off-sheet MCU_PA7
MCU_PA8: P6.28 ; off-sheet MCU_PA8
MCU_PA9: P4.1 ; off-sheet MCU_PA9
MCU_PA10: P6.32 ; off-sheet MCU_PA10
MCU_PA15: P6.30 ; off-sheet MCU_PA15
MCU_PB0: P3.3 ; off-sheet MCU_PB0
MCU_PB1: P3.4 ; off-sheet MCU_PB1
MCU_PB2: P1.2 ; off-sheet MCU_PB2
MCU_PB4: P1.1 ; off-sheet MCU_PB4
MCU_PB5: P6.18 ; off-sheet MCU_PB5
MCU_PE4: P3.5 ; off-sheet MCU_PE4
MCU_RX1: P3.1 P6.24 ; off-sheet MCU_RX1
MCU_SCL: P6.22 ; off-sheet MCU_SCL
MCU_SDA: P6.20 ; off-sheet MCU_SDA
MCU_SWCLK: SB49.2 ; off-sheet MCU_SWCLK
MCU_SWDIO: SB46.2 ; off-sheet MCU_SWDIO
MCU_SWO: SB47.2 ; off-sheet MCU_SWO
MCU_TX1: P3.2 P6.26 ; off-sheet MCU_TX1
MCU_USART1_RX: P6.14 ; off-sheet MCU_USART1_RX
MCU_USART1_TX: P6.16 ; off-sheet MCU_USART1_TX
MCU_WAKE: P4.2 ; off-sheet MCU_WAKE
MIC_N: P5.37 ; off-sheet MIC_N
MIC_P: P5.39 ; off-sheet MIC_P
NRST: P6.1 SB19.1 SB48.2 ; off-sheet NRST
ON_OFF_GNSS: P5.6 ; off-sheet ON_OFF_GNSS
PG: P1.6 ; off-sheet PG
PWM_DAC: P5.40 ; off-sheet PWM_DAC
PWR_CTRL: P3.7 P5.22 ; off-sheet PWR_CTRL
PWR_ENn: P6.3 ; off-sheet PWR_ENn
RESET_CELL: P5.1 ; off-sheet RESET_CELL
RESET_GNSS: P5.2 ; off-sheet RESET_GNSS
RING_CELL: P5.5 ; off-sheet RING_CELL
RTS_CELL_3V3: P5.28 ; off-sheet RTS_CELL_3V3
RX1_GNSS: P5.16 ; off-sheet RX1_GNSS
RX_GNSS_3V3: P5.34 ; off-sheet RX_GNSS_3V3
RXDAUX_CELL: P5.25 ; off-sheet RXDAUX_CELL
SCL: P1.10 P6.9 ; off-sheet SCL
SDA: P1.9 P6.7 ; off-sheet SDA
SENS_CTRL: P6.11 ; off-sheet SENS_CTRL
SYSTEM_ON_GNSS: P5.8 ; off-sheet SYSTEM_ON_GNSS
T_SWCLK: P6.6 SB49.1 ; off-sheet T_SWCLK
T_SWDIO: P6.2 SB46.1 ; off-sheet T_SWDIO
T_SWO: P6.4 SB47.1 ; off-sheet T_SWO
TX1_GNSS: P5.14 ; off-sheet TX1_GNSS
TX_GNSS_3V3: P5.32 ; off-sheet TX_GNSS_3V3
TXDAUX_CELL: P5.23 ; off-sheet TXDAUX_CELL
VRTC: P5.31 ; off-sheet VRTC
NetP2_3: P2.3 SB19.2
NetP3_8: P3.8 SB45.1

Not connected (* = marked no-connect by the designer): P2 1* 2* 8*; P4 5* 6*

### Library data of the parts
P1 = Header 10: Manufacturer: SparkFun Electronics; Manufacturer Part No.: PRT-11417; Part Description: Arduino Stackable Header Kit; Specification: 10 pins; Value: PRT-11417; Supplier: Digi-Key; Supplier part number: 1568-1413-ND
P2 P3 = Header 8: Part Description: Arduino Connector; Specification: 8 pins
P4 = Header 6: Part Description: Arduino Connector; Specification: 6 pins
P5 P6 = Header 20X2: Manufacturer: MPE-Garry; Manufacturer Part No.: 087-2-040-0-S-XS0-1260; Part Description: Typical Header; Specification: 40 pins, 2 rows, 2.54 mm pitch; Value: 087-2-040-0-S-XS0-1260; Supplier: Rutronik; Supplier part number: COREC36718; Link: https://www.rutronik24.com/product/mpegarry/087-2-040-0-s-xs0-1260/6123588.html
SB19 SB46-SB49 = Solderbridge Shorted: Manufacturer: *; Value: Solderbridge; Supplier: *; Supplier part number: *
SB45 = Solderbridge: Manufacturer: *; Value: Solderbridge; Supplier: *; Supplier part number: *

## Sheet ST Link.SchDoc
size A3
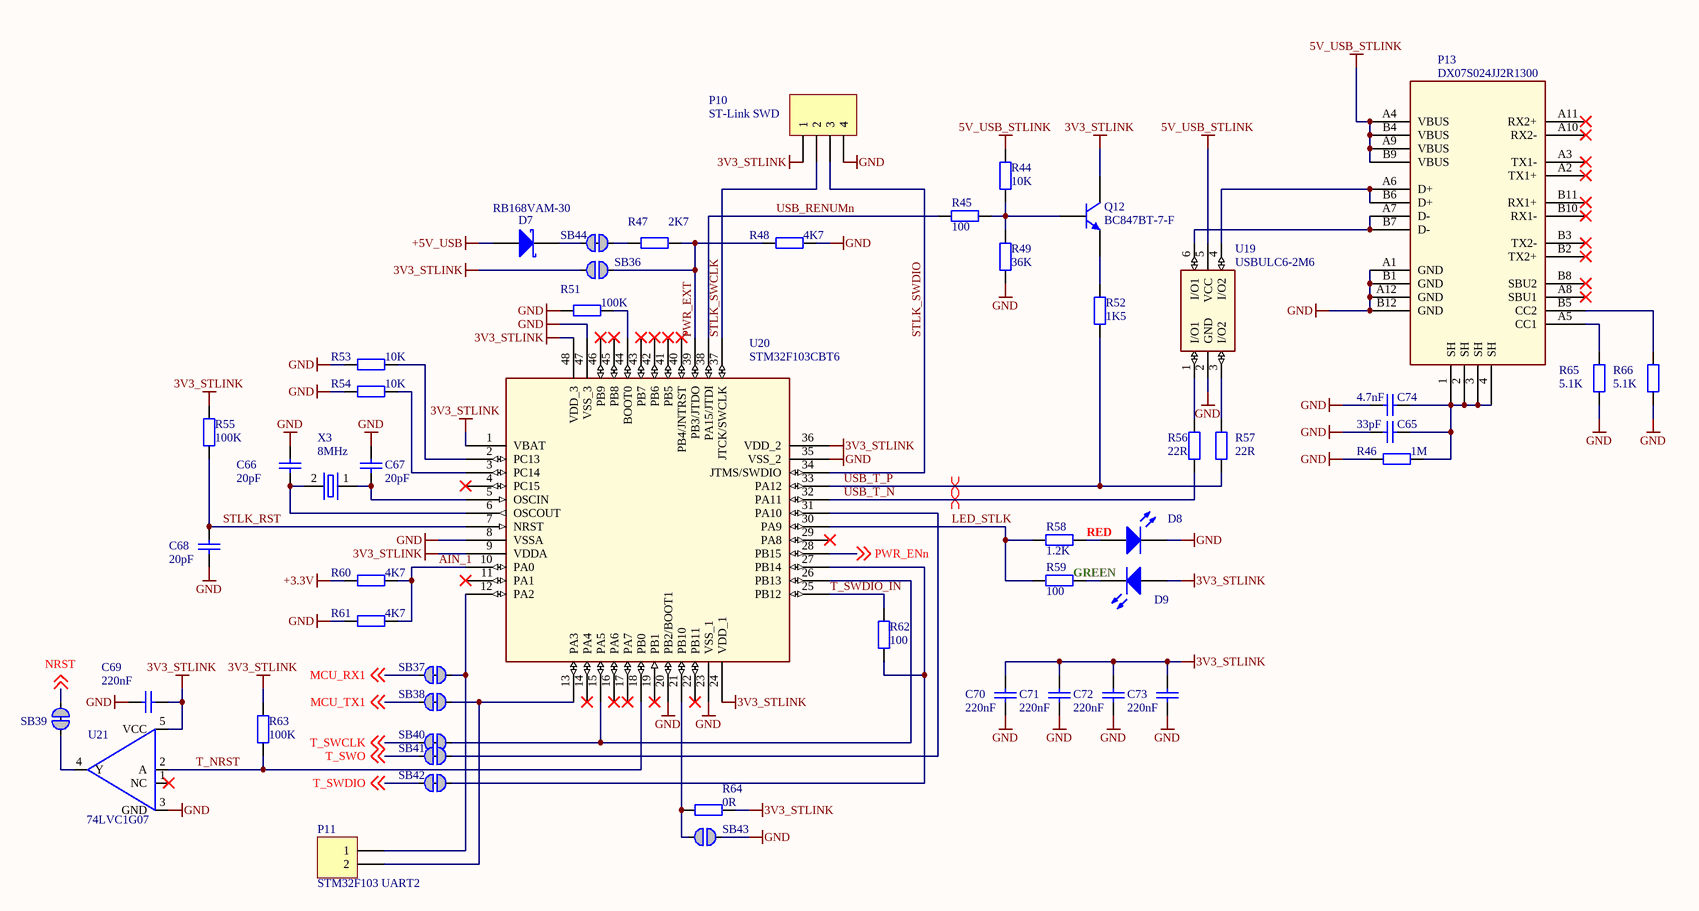
[diagram p4: ST Link.SchDoc]

### Parts
C65  value 33pF  [C0402]  (hidden comment: Cap Semi)
C66  value 20pF  [C0402]  (hidden comment: Cap Semi)
C67  value 20pF  [C0402]  (hidden comment: Cap Semi)
C68  value 20pF  [C0402]  (hidden comment: Cap Semi)
C69  value 220nF  [C0402]  (hidden comment: Cap Semi)
C70  value 220nF  [C0402]  (hidden comment: Cap Semi)
C71  value 220nF  [C0402]  (hidden comment: Cap Semi)
C72  value 220nF  [C0402]  (hidden comment: Cap Semi)
C73  value 220nF  [C0402]  (hidden comment: Cap Semi)
C74  value 4.7nF  [C0402]  (hidden comment: Cap Semi)
D7  RB168VAM-30  [SOD323]
D8  LED  [PICOLED]  (value not drawn)
D9  LED  [PICOLED]  (value not drawn)
P10  ST-Link SWD  [HDR1X4]  (no BOM)
P11  STM32F103 UART2  [HDR1X2]  (no BOM)
P13  DX07S024JJ2R1300  [DX07_USB_C]
Q12  BC847BT-7-F  [SOT-523_custom]
R44  value 10K  [R0402]  (hidden comment: Res2)
R45  value 100  [R0402]  (hidden comment: Res2)
R46  value 1M  [R0402]  (hidden comment: Res2)
R47  value 2K7  [R0402]  (hidden comment: Res2)
R48  value 4K7  [R0402]  (hidden comment: Res2)
R49  value 36K  [R0402]  (hidden comment: Res2)
R51  value 100K  [R0402]  (hidden comment: Res2)
R52  value 1K5  [R0402]  (hidden comment: Res2)
R53  value 10K  [R0402]  (hidden comment: Res2)
R54  value 10K  [R0402]  (hidden comment: Res2)  (no BOM)
R55  value 100K  [R0402]  (hidden comment: Res2)
R56  value 22R  [R0402]  (hidden comment: Res2)
R57  value 22R  [R0402]  (hidden comment: Res2)
R58  value 1.2K  [R0402]  (hidden comment: Res2)
R59  value 100  [R0402]  (hidden comment: Res2)
R60  value 4K7  [R0402]  (hidden comment: Res2)
R61  value 4K7  [R0402]  (hidden comment: Res2)
R62  value 100  [R0402]  (hidden comment: Res2)
R63  value 100K  [R0402]  (hidden comment: Res2)
R64  value 0R  [R0402]  (hidden comment: Res2)
R65  value 5.1K  [R0402]  (hidden comment: Res2)
R66  value 5.1K  [R0402]  (hidden comment: Res2)
SB36  Solderbridge  [Solderbridge]  (value not drawn)  (no BOM)
SB37  Solderbridge  [Solderbridge_Shorted]  (value not drawn)  (net tie, no BOM)
SB38  Solderbridge  [Solderbridge_Shorted]  (value not drawn)  (net tie, no BOM)
SB39  Solderbridge  [Solderbridge_Shorted]  (value not drawn)  (net tie, no BOM)
SB40  Solderbridge  [Solderbridge_Shorted]  (value not drawn)  (net tie, no BOM)
SB41  Solderbridge  [Solderbridge_Shorted]  (value not drawn)  (net tie, no BOM)
SB42  Solderbridge  [Solderbridge_Shorted]  (value not drawn)  (net tie, no BOM)
SB43  Solderbridge  [Solderbridge]  (value not drawn)  (no BOM)
SB44  Solderbridge  [Solderbridge_Shorted]  (value not drawn)  (net tie, no BOM)
U19  USBULC6-2M6  [Micro_QFN_6L]
U20  STM32F103CBT6  [QFP48 7X7]
U21  74LVC1G07  [X2-DFN1410-6]
X3  8MHz  [crystal_5032]

### Nets
3V3_STLINK: C69.2 C70.2 C71.2 C72.2 C73.2 D9.1(A) P10.1 Q12.2(C) R55.1 R63.1 R64.1 SB36.1 U20.1(VBAT) U20.9(VDDA) U20.24(VDD_1) U20.36(VDD_2) U20.48(VDD_3) U21.5(VCC)
5V_USB_STLINK: P13.A4(VBUS) P13.A9(VBUS) P13.B4(VBUS) P13.B9(VBUS) R44.2 U19.5(VCC)
+3.3V: R60.2
+5V_USB: D7.1(A)
GND: C65.1 C66.2 C67.2 C68.1 C69.1 C70.1 C71.1 C72.1 C73.1 C74.1 D8.2(K) P10.4 P13.A1(GND) P13.A12(GND) P13.B1(GND) P13.B12(GND) R46.1 R48.1 R49.1 R51.2 R53.2 R54.2 R61.2 R65.1 R66.1 SB43.2 U19.2(GND) U20.8(VSSA) U20.20(PB2/BOOT1) U20.23(VSS_1) U20.35(VSS_2) U20.47(VSS_3) U21.3(GND)
AIN_1: R60.1 R61.1 U20.10(PA0)
LED_STLK: R58.1 R59.1 U20.30(PA9)
MCU_RX1: SB37.1 ; off-sheet MCU_RX1
MCU_TX1: SB38.1 ; off-sheet MCU_TX1
NRST: SB39.2 ; off-sheet NRST
PWR_ENn: U20.28(PB15) ; off-sheet PWR_ENn
PWR_EXT: R47.1 R48.2 SB36.2 U20.39(PB3/JTDO)
STLK_RST: C68.2 R55.2 U20.7(NRST)
STLK_SWCLK: P10.2 U20.37(JTCK/SWCLK)
STLK_SWDIO: P10.3 U20.34(JTMS/SWDIO)
T_NRST: R63.2 U20.18(PB0) U21.2(A)
T_SWCLK: SB40.1 ; off-sheet T_SWCLK
T_SWDIO: SB42.1 ; off-sheet T_SWDIO
T_SWDIO_IN: R62.1 U20.25(PB12)
T_SWO: SB41.1 ; off-sheet T_SWO
USB_RENUMn: R45.2 U20.38(PA15/JTDI)
USB_T_N: R56.1 U20.32(PA11)
USB_T_P: R52.1 R57.1 U20.33(PA12)
NetC65_2: C65.2 C74.2 P13.1(SH) P13.2(SH) P13.3(SH) P13.4(SH) R46.2
NetC66_1: C66.1 U20.6(OSCOUT) X3.2
NetC67_1: C67.1 U20.5(OSCIN) X3.1
NetD7_2: D7.2(K) SB44.1
NetD8_1: D8.1(A) R58.2
NetD9_2: D9.2(K) R59.2
NetP11_1: P11.1 SB37.2 U20.12(PA2)
NetP11_2: P11.2 SB38.2 U20.13(PA3)
NetP13_A5: P13.A5(CC1) R65.2
NetP13_A6: P13.A6(D+) P13.B6(D+) U19.4(I/O2)
NetP13_A7: P13.A7(D-) P13.B7(D-) U19.6(I/O1)
NetP13_B5: P13.B5(CC2) R66.2
NetQ12_1: Q12.1(B) R44.1 R45.1 R49.2
NetQ12_3: Q12.3(E) R52.2
NetR47_2: R47.2 SB44.2
NetR51_1: R51.1 U20.44(BOOT0)
NetR53_1: R53.1 U20.2(PC13)
NetR54_1: R54.1 U20.3(PC14)
NetR56_2: R56.2 U19.1(I/O1)
NetR57_2: R57.2 U19.3(I/O2)
NetR62_2: R62.2 SB42.2 U20.27(PB14)
NetR64_2: R64.2 SB43.1 U20.21(PB10)
NetSB39_1: SB39.1 U21.4(Y)
NetSB40_2: SB40.2 U20.15(PA5) U20.26(PB13)
NetSB41_2: SB41.2 U20.31(PA10)

Not connected (* = marked no-connect by the designer): P13 A2(TX1+)* A3(TX1-)* A8(SBU1)* A10(RX2-)* A11(RX2+)* B2(TX2+)* B3(TX2-)* B8(SBU2)* B10(RX1-)* B11(RX1+)*; U20 4(PC15)* 11(PA1)* 14(PA4)* 16(PA6)* 17(PA7)* 19(PB1)* 22(PB11)* 29(PA8)* 40(PB4/JNTRST)* 41(PB5)* 42(PB6)* 43(PB7)* 45(PB8)* 46(PB9)*; U21 1(NC)*

### Layout directives
differential pair: USB_T_N, USB_T_P

### Notes on the sheet
- RED
- (near R59) GREEN

### Library data of the parts
C65-C74 = Cap Semi: as C47 on sheet Power management; Supplier: Rutronik; Supplier part number: KKK14556; Link: https://www.rutronik24.com/product/yageo/cc0402jrnpo9bn100/29735.html
D7 = D Schottky: as D3 on sheet Power management; Manufacturer Part No.: RB168VAM-30; Supplier: Rutronik; Supplier part number: RB168VAM-30; Value: RB168VAM-30; Link: http://rohmfs.rohm.com/en/products/databook/datasheet/discrete/diode/schottky_barrier/rb168vam-30tr-e.pdf
D8 = LED2: as D5 on sheet Power management; Supplier: Rutronik; Supplier part number: LED24884; Part Description: Typical SMD LED; Link: https://www.rutronik24.com/product/rohm/sml-p12utt86/8485748.html
D9 = LED2: as D4 on sheet Power management; Supplier: Rutronik; Supplier part number: LED26047; Part Description: Typical SMD LED; Link: https://www.rutronik24.com/product/rohm/sml-p13ptt86r/11064312.html
P10 = Header 4: Header, 4-Pin
P11 = Header 2: Header, 2-Pin
P13 = DX07S024JJ2R1300: 24P USB C DUAL SMT ON BOARD; Manufacturer: JAE; Specification: Type C; Link: https://www.rutronik24.com/product/jae/dx07s024jj2r1300/8301548.html; Manufacturer Part No.: DX07S024JJ2R1300; Part Description: 24P USB C DUAL SMT ON BOARD; Supplier: Rutronik; Supplier part number: CONIO1808; Value: DX07S024JJ2R1300
Q12 = NPN: NPN Bipolar Transistor; Manufacturer: Diodes Inc.; Manufacturer Part No.: BC847AT-7-F; Part Description: 45V NPN SMALL SIGNAL TRANSISTOR; Specification: 45V, 0.1A; Value: BC847AT-7-F; Link: https://www.rutronik24.com/product/diodes+inc/bc847at-7-f/11676160.html; Supplier: Rutronik; Supplier part number: BC847AT-7-F
R44 R45 R47-R49 R51-R66 = Res2: as R20 on sheet Modem GNSS; Supplier: Rutronik; Supplier part number: WRC40976; Link: https://www.rutronik24.com/product/asj/cr10-103-jk/54295.html
R46 = Res2: as R17 on sheet Modem GNSS; Supplier: Rutronik; Supplier part number: WRC53079; Link: https://www.rutronik24.com/product/yageo/rc0402fr-070rl/5183530.html
SB37-SB42 SB44 = Solderbridge Shorted: Manufacturer: *; Value: Solderbridge; Supplier: *; Supplier part number: *
U19 = USBULC6-2M6: Ultra large bandwidth ESD protection; Manufacturer: STMicroelectronics; Specification: 6V, 0.6pF; Link: https://www.rutronik24.com/product/st/usbulc6-2m6/3623499.html; Manufacturer Part No.: USBULC6-2M6; Part Description: Ultra large bandwidth ESD protection; Supplier: Rutronik; Supplier part number: DTRL11259; Value: USBULC6-2M6
U20 = STM32F103CBT6: Medium-density performance line ARM-based 32-bit MCU with 64KB Flash; Manufacturer: STMicroelectronics; Part Description: ARM® Cortex®-M3 STM32F1 Microcontroller IC 32-Bit 72MHz 128KB (128K x 8) FLASH; Specification: 128KB Flash, 20KB RAM; Link: https://www.rutronik24.com/product/st/stm32f103cbt6/18975.html; Manufacturer Part No.: STM32F103CBT6; Supplier: Rutronik; Supplier part number: ICMCU17424; Value: STM32F103CBT6
U21 = 74LVC1G07: SINGLE BUFFER/DRIVER WITH OPEN DRAIN OUTPUT; Manufacturer: STMicroelectronics; Manufacturer Part No.: 74LVC1G07FZ4-7; Specification: 5.5V, 1.65V; Value: 74LVC1G07FZ4-7; Link: https://www.rutronik24.com/product/diodes+inc/74lvc1g07fz4-7/11672158.html; Part Description: SINGLE BUFFER/DRIVER WITH OPEN DRAIN OUTPUT; Supplier: Rutronik; Supplier part number: 74LVC1G07FZ4-7
X3 = XTL-000011-01: Manufacturer: Kyocera; Manufacturer Part No.: CX5032GB08000H0HEQZ1; Part Description: XTAL 5.0x3.2mmm; Specification: 8MHz, 12pF, 20ppm; Value: CX5032GB08000H0HEQZ1; Supplier: Rutronik; Supplier part number: CX5032GB08000H0HEQZ1; Link: https://global.kyocera.com/prdct/electro/product/crystal-device/xtal/
SB36 SB43 = Solderbridge: Manufacturer: *; Value: Solderbridge; Supplier: *; Supplier part number: *